# EAGLE design echo_in_the_lab (EAGLE 9.1.3)
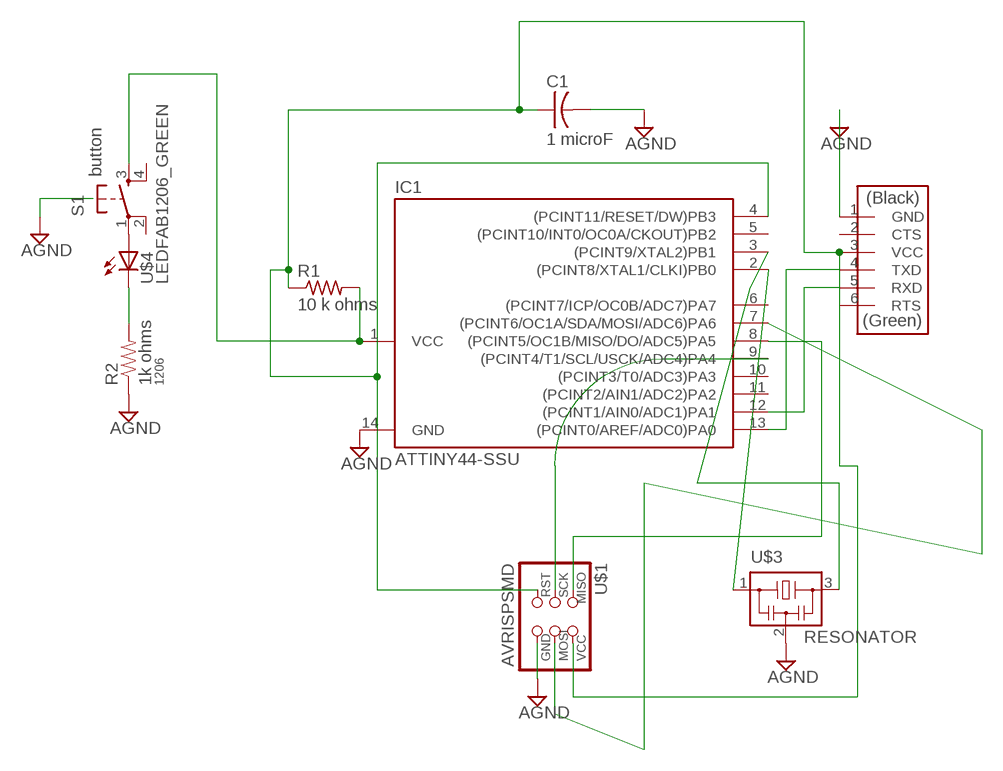
[diagram p0: schematic, sheet 1]

## Parts
C1  1 microF  CAP-US1206FAB  [C1206FAB]
IC1  ATTINY44-SSU  [SOIC14]
R1  10 k ohms  RES-US1206W  [R1206W]
R2  1k ohms  RESISTOR1206  [1206]
S1  button  6MM_SWITCH6MM_SWITCH  [6MM_SWITCH]
U$1  AVRISPSMD  [2X03SMD]
U$2  FTDI-SMD-HEADER  [1X06SMD]
U$3  RESONATOR  [EFOBM]
U$4  LEDFAB1206_GREEN  LEDFAB1206  [LED1206FAB]

## Nets
AGND: C1.2 IC1.14(GND) R2.1 U$1.6(GND) U$2.1(GND) U$3.2
N$1: IC1.1(VCC) R1.2 S1.3(S)
N$2: R2.2 U$4.2(C)
N$3: IC1.13((PCINT0/AREF/ADC0)PA0) U$2.4(TXD)
N$4: IC1.12((PCINT1/AIN0/ADC1)PA1) U$2.5(RXD)
N$5: S1.1(P) U$4.1(A)
N$6: IC1.7((PCINT6/OC1A/SDA/MOSI/ADC6)PA6) U$1.4(MOSI)
N$7: IC1.2((PCINT8/XTAL1/CLKI)PB0) U$3.1
N$8: IC1.3((PCINT9/XTAL2)PB1) U$3.3
N$9: C1.1 IC1.4((PCINT11/RESET/DW)PB3) R1.1 U$1.2(VCC) U$1.5(RST) U$2.3(VCC) U$2.6(RTS)
N$10: IC1.9((PCINT4/T1/SCL/USCK/ADC4)PA4) U$1.3(SCK)
N$11: IC1.8((PCINT5/OC1B/MISO/DO/ADC5)PA5) U$1.1(MISO)
Unconnected: IC1.5((PCINT10/INT0/OC0A/CKOUT)PB2) IC1.6((PCINT7/ICP/OC0B/ADC7)PA7) IC1.10((PCINT3/T0/ADC3)PA3) IC1.11((PCINT2/AIN1/ADC2)PA2) S1.2(P1) S1.4(S1) U$2.2(CTS)

## Library data of the parts
C1 = fab:CAP-US
IC1 = fab:ATTINY44
R1 = fab:RES-US: Resistor (US Symbol) Variants with postfix FAB are widened to allow the routing of internal traces
R2 = passives:RESISTOR: Resistor Basic schematic elements and footprints for 0603, 1206, and PTH resistors.; PACKAGE: 1206
S1 = fab:6MM_SWITCH: OMRON SWITCH
U$1 = fab:AVRISP
U$2 = fab:FTDI-SMD-HEADER
U$3 = fab:RESONATOR
U$4 = fab:LED: LED

## Board
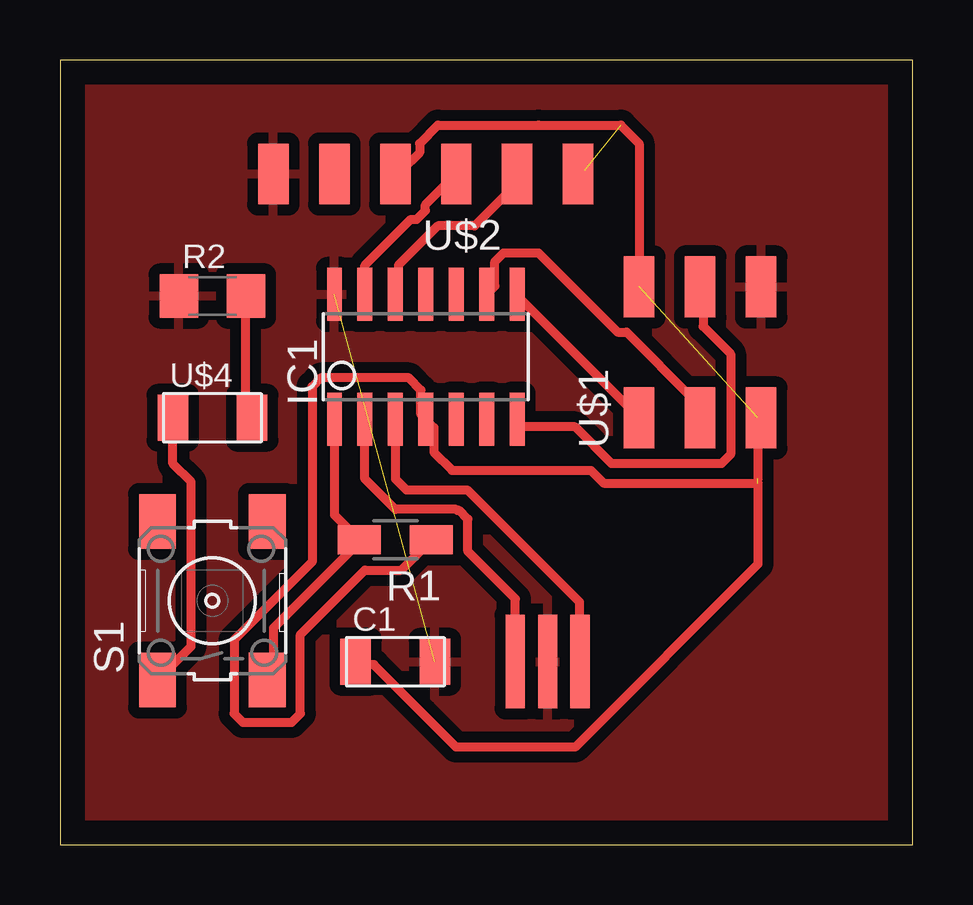
[diagram p1: board, top side]

Size 35.54 x 32.69 mm. Coordinates in mm from the lower left corner, seen from the top.
Outline: 0,0 35.54,0 35.54,32.69 0,32.69 0,0
Copper layers (1*16): Top 0.035mm / dielectric 1.5mm / Bottom 0.035mm
Design rules "default *": minimum track width 15mil, minimum drill 0.35mm, track to track 17mil, track to pad 17mil, pad to pad 17mil, via to via 17mil, smd to smd 17mil, copper to edge 40mil, drill to drill 6mil, minimum pad ring 10mil, minimum via ring 8mil, stop-mask expansion 4mil, vias tented up to drill 0mil, thermal gap 18mil

### Footprints (pad centres in the part's own frame; a part is rotated, then mirrored left to right if it is on the bottom)
C1206FAB = smd 1.27 x 1.905: 1 -1.651,0; 2 1.651,0
SOIC14 = smd 0.61 x 2.21: 1 -3.81,-2.603; 2 -2.54,-2.603; 3 -1.27,-2.603; 4 0,-2.603; 5 1.27,-2.603; 6 2.54,-2.603; 7 3.81,-2.603; 8 3.81,2.603; 9 2.54,2.603; 10 1.27,2.603; 11 0,2.603; 12 -1.27,2.603; 13 -2.54,2.603; 14 -3.81,2.603
R1206W = smd 1.8 x 1.2: 1 -1.499,0; 2 1.499,0
1206 = smd 1.6 x 1.8: 1 -1.4,0; 2 1.4,0
6MM_SWITCH = smd 2.286 x 1.524: 1 -3.302,2.286; 2 3.302,2.286; 3 -3.302,-2.286; 4 3.302,-2.286
2X03SMD = smd 2.54 x 1.27: 1 -2.54,2.54; 2 2.92,2.54; 3 -2.54,0; 4 2.92,0; 5 -2.54,-2.54; 6 2.92,-2.54
1X06SMD = smd 2.54 x 1.27: 1 0,6.35; 2 0,3.81; 3 0,1.27; 4 0,-1.27; 5 0,-3.81; 6 0,-6.35
EFOBM = smd 0.8 x 3.9: 1 -1.35,0; 2 0,0; 3 1.35,0
LED1206FAB = smd 1.27 x 1.905: 1 -1.651,0; 2 1.651,0

### Placement (x,y rotation side)
C1  13.97,7.62 0 top
IC1  15.24,20.32 0 top
R1  13.97,12.7 180 top
R2  6.35,22.86 0 top
S1  6.35,10.16 90 top
U$1  26.67,20.32 90 top
U$2  15.24,27.94 90 top
U$3  20.32,7.62 0 top
U$4  6.35,17.78 0 top

### Tracks (layer width: path | path; a pad name or v marks a point on that pad's centre or on a via)
AGND  (1 unrouted)
  pour Top (isolate 0.457): -1.27,34.29 36.83,34.29 36.83,-2.54 -1.27,-2.54
N$1
  Top 0.381: S1.3 8.89,7.11 8.89,9.02 12.32,12.45 R1.2 11.43,13.74 IC1.1
N$2
  Top 0.381: R2.2 7.75,22.73 7.75,17.78 U$4.2
N$3
  Top 0.381: 16.51,27.81 U$2.4 15.23,26.66 15.23,26.41 14.86,26.05 14.62,26.05 12.7,24.13 IC1.13
N$4
  Top 0.381: IC1.12 14.1,23.02 14.1,24.13 15.75,25.78 17.27,25.78 19.18,27.69 U$2.5
N$5
  Top 0.381: U$4.1 4.7,15.88 5.46,15.11 5.46,8.26 S1.1
N$6
  Top 0.381: IC1.7 19.18,17.4 21.46,17.4 22.99,15.88 27.56,15.88 27.94,16.26 27.94,20.45 26.8,21.59 26.8,23.11 U$1.4
N$7
  Top 0.381: U$3.1 18.97,10.24 16.99,12.22 16.99,13.56 16.63,13.92 16.56,13.92 16.51,13.97 13.97,13.97 12.7,15.24 IC1.2
N$8
  Top 0.381: U$3.3 21.64,7.66 21.64,10.11 16.97,14.78 14.43,14.78 13.97,15.24 IC1.3
N$9  (3 unrouted)
  Top 0.381: R1.1 15.37,12.45 15.24,12.45 14.22,11.43 12.7,11.43 10.02,8.75 10.02,5.46 9.66,5.09 7.62,5.09 7.25,5.46 7.25,8.53 10.5,11.78 10.5,19.08 10.87,19.44 14.53,19.44 15.04,18.94 15.04,17.92 IC1.4 | U$2.3 14.22,28.07 14.99,28.83 14.99,29.21 15.75,29.97 19.94,29.97 23.37,29.97 24.13,29.21 U$1.2 | 21.84,28.07 U$2.6 | 29.08,15.24 29.08,17.78 U$1.5 | C1.1 12.32,7.49 13.08,7.49 16.51,4.06 21.46,4.06 29.08,11.68 29.08,15.06 22.65,15.06 22.12,15.6 16.34,15.6 15.58,16.35 15.58,17.37 IC1.4 | 15.37,17.59 IC1.4
N$10
  Top 0.381: U$1.3 26.42,17.78 26.42,18.54 23.61,21.35 23.24,21.35 19.93,24.65 18.49,24.65 18.12,24.29 18.12,23.27 IC1.9
N$11
  Top 0.381: U$1.1 19.18,22.73 IC1.8